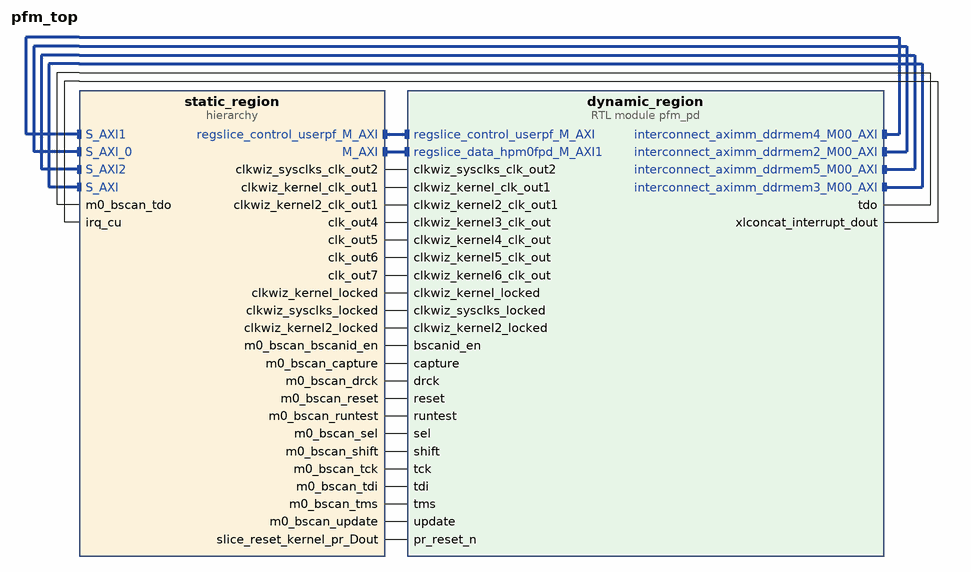
[diagram p0: block diagram of the top level]
# Vivado block design pfm_top, xczu9eg-ffvb1156-2-e, Vivado 2020.1
create_bd_design pfm_top

create_bd_cell -type module -reference pfm_pd dynamic_region
create_bd_cell -type hier static_region

# ---- hierarchy /static_region ----
current_bd_instance /static_region
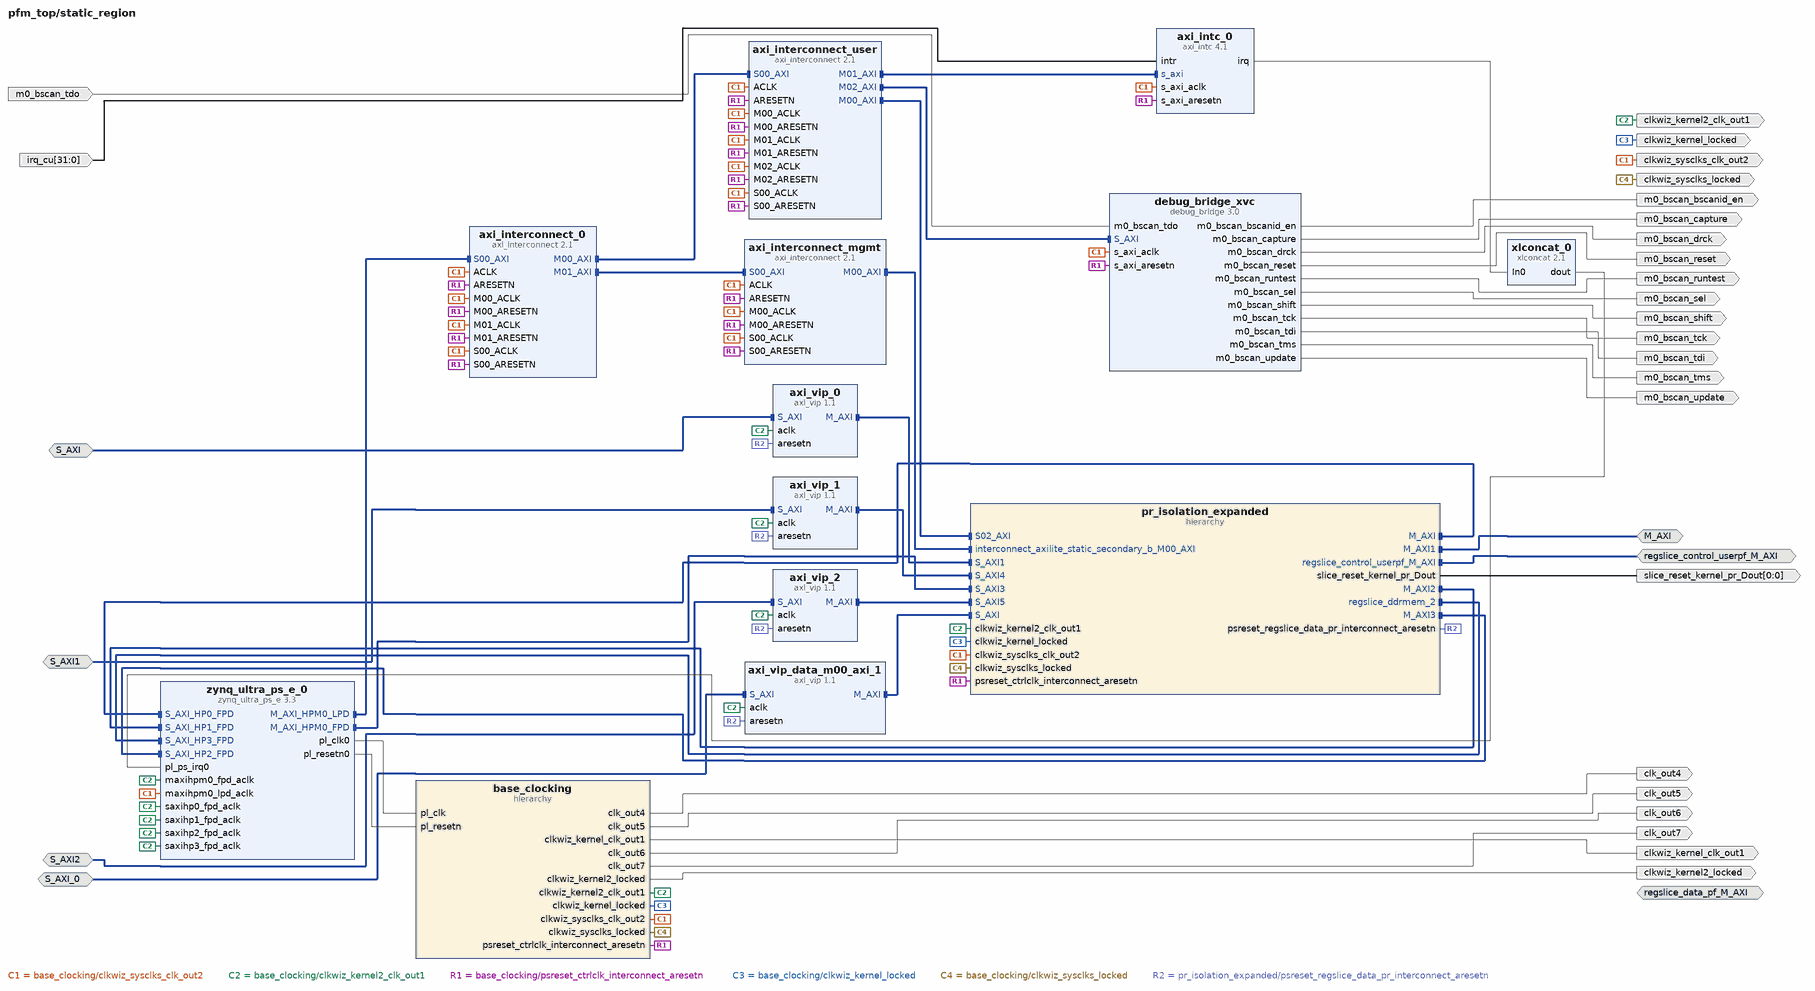
[diagram p1: block diagram inside /static_region]
create_bd_intf_pin -mode Master -vlnv xilinx.com:interface:aximm_rtl:1.0 M_AXI
create_bd_intf_pin -mode Slave -vlnv xilinx.com:interface:aximm_rtl:1.0 S_AXI
create_bd_intf_pin -mode Slave -vlnv xilinx.com:interface:aximm_rtl:1.0 S_AXI1
create_bd_intf_pin -mode Slave -vlnv xilinx.com:interface:aximm_rtl:1.0 S_AXI2
create_bd_intf_pin -mode Slave -vlnv xilinx.com:interface:aximm_rtl:1.0 S_AXI_0
create_bd_intf_pin -mode Master -vlnv xilinx.com:interface:aximm_rtl:1.0 regslice_control_userpf_M_AXI
create_bd_intf_pin -mode Master -vlnv xilinx.com:interface:aximm_rtl:1.0 regslice_data_pf_M_AXI
create_bd_pin -dir O -type clk clk_out4
create_bd_pin -dir O -type clk clk_out5
create_bd_pin -dir O -type clk clk_out6
create_bd_pin -dir O -type clk clk_out7
create_bd_pin -dir O -type clk clkwiz_kernel2_clk_out1
create_bd_pin -dir O clkwiz_kernel2_locked
create_bd_pin -dir O -type clk clkwiz_kernel_clk_out1
create_bd_pin -dir O clkwiz_kernel_locked
create_bd_pin -dir O -type clk clkwiz_sysclks_clk_out2
create_bd_pin -dir O clkwiz_sysclks_locked
create_bd_pin -dir I -from 31 -to 0 irq_cu
create_bd_pin -dir O m0_bscan_bscanid_en
create_bd_pin -dir O m0_bscan_capture
create_bd_pin -dir O -type clk m0_bscan_drck
create_bd_pin -dir O -type rst m0_bscan_reset
create_bd_pin -dir O m0_bscan_runtest
create_bd_pin -dir O m0_bscan_sel
create_bd_pin -dir O m0_bscan_shift
create_bd_pin -dir O -type clk m0_bscan_tck
create_bd_pin -dir O m0_bscan_tdi
create_bd_pin -dir I m0_bscan_tdo
create_bd_pin -dir O m0_bscan_tms
create_bd_pin -dir O -type clk m0_bscan_update
create_bd_pin -dir O -from 0 -to 0 slice_reset_kernel_pr_Dout

create_bd_cell -type ip -vlnv xilinx.com:ip:axi_intc:4.1 axi_intc_0
set_property -dict {CONFIG.C_ASYNC_INTR 0xFFFFFFFF CONFIG.C_IRQ_IS_LEVEL 1} [get_bd_cells axi_intc_0]
create_bd_cell -type ip -vlnv xilinx.com:ip:axi_interconnect:2.1 axi_interconnect_0
create_bd_cell -type ip -vlnv xilinx.com:ip:axi_interconnect:2.1 axi_interconnect_mgmt
set_property -dict {CONFIG.NUM_MI 1} [get_bd_cells axi_interconnect_mgmt]
create_bd_cell -type ip -vlnv xilinx.com:ip:axi_interconnect:2.1 axi_interconnect_user
set_property -dict {CONFIG.NUM_MI 3} [get_bd_cells axi_interconnect_user]
create_bd_cell -type ip -vlnv xilinx.com:ip:axi_vip:1.1 axi_vip_0
create_bd_cell -type ip -vlnv xilinx.com:ip:axi_vip:1.1 axi_vip_1
create_bd_cell -type ip -vlnv xilinx.com:ip:axi_vip:1.1 axi_vip_2
create_bd_cell -type ip -vlnv xilinx.com:ip:axi_vip:1.1 axi_vip_data_m00_axi_1
create_bd_cell -type hier base_clocking
create_bd_cell -type ip -vlnv xilinx.com:ip:debug_bridge:3.0 debug_bridge_xvc
set_property -dict [list \
  CONFIG.C_BSCAN_MUX 2 \
  CONFIG.C_DEBUG_MODE 2 \
  CONFIG.C_NUM_BS_MASTER 1 \
  CONFIG.C_XVC_HW_ID 0x0002 \
] [get_bd_cells debug_bridge_xvc]
create_bd_cell -type hier pr_isolation_expanded
create_bd_cell -type ip -vlnv xilinx.com:ip:xlconcat:2.1 xlconcat_0
set_property -dict {CONFIG.NUM_PORTS 1} [get_bd_cells xlconcat_0]
create_bd_cell -type ip -vlnv xilinx.com:ip:zynq_ultra_ps_e:3.3 zynq_ultra_ps_e_0
set_property -dict [list \
  CONFIG.PSU_BANK_0_IO_STANDARD LVCMOS18 \
  CONFIG.PSU_BANK_1_IO_STANDARD LVCMOS18 \
  CONFIG.PSU_BANK_2_IO_STANDARD LVCMOS18 \
  CONFIG.PSU_DYNAMIC_DDR_CONFIG_EN 1 \
  CONFIG.PSU_USB3__DUAL_CLOCK_ENABLE 1 \
  CONFIG.PSU__CAN1__PERIPHERAL__ENABLE 1 \
  CONFIG.PSU__CAN1__PERIPHERAL__IO {MIO 24 .. 25} \
  CONFIG.PSU__CRF_APB__ACPU_CTRL__FREQMHZ 1200 \
  CONFIG.PSU__CRF_APB__ACPU_CTRL__SRCSEL APLL \
  CONFIG.PSU__CRF_APB__APLL_CTRL__SRCSEL PSS_REF_CLK \
  CONFIG.PSU__CRF_APB__DBG_FPD_CTRL__FREQMHZ 250 \
  CONFIG.PSU__CRF_APB__DBG_FPD_CTRL__SRCSEL IOPLL \
  CONFIG.PSU__CRF_APB__DBG_TRACE_CTRL__FREQMHZ 250 \
  CONFIG.PSU__CRF_APB__DBG_TRACE_CTRL__SRCSEL IOPLL \
  CONFIG.PSU__CRF_APB__DBG_TSTMP_CTRL__FREQMHZ 250 \
  CONFIG.PSU__CRF_APB__DBG_TSTMP_CTRL__SRCSEL IOPLL \
  CONFIG.PSU__CRF_APB__DDR_CTRL__FREQMHZ 1067 \
  CONFIG.PSU__CRF_APB__DDR_CTRL__SRCSEL DPLL \
  CONFIG.PSU__CRF_APB__DPDMA_REF_CTRL__FREQMHZ 600 \
  CONFIG.PSU__CRF_APB__DPDMA_REF_CTRL__SRCSEL APLL \
  CONFIG.PSU__CRF_APB__DPLL_CTRL__SRCSEL PSS_REF_CLK \
  CONFIG.PSU__CRF_APB__DP_AUDIO_REF_CTRL__SRCSEL RPLL \
  CONFIG.PSU__CRF_APB__DP_STC_REF_CTRL__SRCSEL RPLL \
  CONFIG.PSU__CRF_APB__DP_VIDEO_REF_CTRL__SRCSEL VPLL \
  CONFIG.PSU__CRF_APB__GDMA_REF_CTRL__FREQMHZ 600 \
  CONFIG.PSU__CRF_APB__GDMA_REF_CTRL__SRCSEL APLL \
  CONFIG.PSU__CRF_APB__GPU_REF_CTRL__FREQMHZ 500 \
  CONFIG.PSU__CRF_APB__GPU_REF_CTRL__SRCSEL IOPLL \
  CONFIG.PSU__CRF_APB__TOPSW_LSBUS_CTRL__FREQMHZ 100 \
  CONFIG.PSU__CRF_APB__TOPSW_LSBUS_CTRL__SRCSEL IOPLL \
  CONFIG.PSU__CRF_APB__TOPSW_MAIN_CTRL__FREQMHZ 533.33 \
  CONFIG.PSU__CRF_APB__TOPSW_MAIN_CTRL__SRCSEL DPLL \
  CONFIG.PSU__CRF_APB__VPLL_CTRL__SRCSEL PSS_REF_CLK \
  CONFIG.PSU__CRL_APB__ADMA_REF_CTRL__FREQMHZ 500 \
  CONFIG.PSU__CRL_APB__ADMA_REF_CTRL__SRCSEL IOPLL \
  CONFIG.PSU__CRL_APB__CAN1_REF_CTRL__FREQMHZ 100 \
  CONFIG.PSU__CRL_APB__CAN1_REF_CTRL__SRCSEL IOPLL \
  CONFIG.PSU__CRL_APB__CPU_R5_CTRL__FREQMHZ 500 \
  CONFIG.PSU__CRL_APB__CPU_R5_CTRL__SRCSEL IOPLL \
  CONFIG.PSU__CRL_APB__DBG_LPD_CTRL__FREQMHZ 250 \
  CONFIG.PSU__CRL_APB__DBG_LPD_CTRL__SRCSEL IOPLL \
  CONFIG.PSU__CRL_APB__GEM3_REF_CTRL__FREQMHZ 125 \
  CONFIG.PSU__CRL_APB__GEM3_REF_CTRL__SRCSEL IOPLL \
  CONFIG.PSU__CRL_APB__I2C0_REF_CTRL__FREQMHZ 100 \
  CONFIG.PSU__CRL_APB__I2C0_REF_CTRL__SRCSEL IOPLL \
  CONFIG.PSU__CRL_APB__I2C1_REF_CTRL__FREQMHZ 100 \
  CONFIG.PSU__CRL_APB__I2C1_REF_CTRL__SRCSEL IOPLL \
  CONFIG.PSU__CRL_APB__IOPLL_CTRL__SRCSEL PSS_REF_CLK \
  CONFIG.PSU__CRL_APB__IOU_SWITCH_CTRL__FREQMHZ 250 \
  CONFIG.PSU__CRL_APB__IOU_SWITCH_CTRL__SRCSEL IOPLL \
  CONFIG.PSU__CRL_APB__LPD_LSBUS_CTRL__FREQMHZ 100 \
  CONFIG.PSU__CRL_APB__LPD_LSBUS_CTRL__SRCSEL IOPLL \
  CONFIG.PSU__CRL_APB__LPD_SWITCH_CTRL__FREQMHZ 500 \
  CONFIG.PSU__CRL_APB__LPD_SWITCH_CTRL__SRCSEL IOPLL \
  CONFIG.PSU__CRL_APB__PCAP_CTRL__FREQMHZ 200 \
  CONFIG.PSU__CRL_APB__PCAP_CTRL__SRCSEL IOPLL \
  CONFIG.PSU__CRL_APB__PL0_REF_CTRL__FREQMHZ 50 \
  CONFIG.PSU__CRL_APB__PL0_REF_CTRL__SRCSEL IOPLL \
  CONFIG.PSU__CRL_APB__QSPI_REF_CTRL__FREQMHZ 125 \
  CONFIG.PSU__CRL_APB__QSPI_REF_CTRL__SRCSEL IOPLL \
  CONFIG.PSU__CRL_APB__RPLL_CTRL__SRCSEL PSS_REF_CLK \
  CONFIG.PSU__CRL_APB__SDIO1_REF_CTRL__FREQMHZ 200 \
  CONFIG.PSU__CRL_APB__SDIO1_REF_CTRL__SRCSEL IOPLL \
  CONFIG.PSU__CRL_APB__TIMESTAMP_REF_CTRL__FREQMHZ 100 \
  CONFIG.PSU__CRL_APB__TIMESTAMP_REF_CTRL__SRCSEL IOPLL \
  CONFIG.PSU__CRL_APB__UART0_REF_CTRL__FREQMHZ 100 \
  CONFIG.PSU__CRL_APB__UART0_REF_CTRL__SRCSEL IOPLL \
  CONFIG.PSU__CRL_APB__UART1_REF_CTRL__FREQMHZ 100 \
  CONFIG.PSU__CRL_APB__UART1_REF_CTRL__SRCSEL IOPLL \
  CONFIG.PSU__CRL_APB__USB0_BUS_REF_CTRL__FREQMHZ 250 \
  CONFIG.PSU__CRL_APB__USB0_BUS_REF_CTRL__SRCSEL IOPLL \
  CONFIG.PSU__CRL_APB__USB3_DUAL_REF_CTRL__FREQMHZ 20 \
  CONFIG.PSU__CRL_APB__USB3_DUAL_REF_CTRL__SRCSEL IOPLL \
  CONFIG.PSU__CRL_APB__USB3__ENABLE 1 \
  CONFIG.PSU__CSUPMU__PERIPHERAL__VALID 1 \
  CONFIG.PSU__DDRC__BUS_WIDTH {64 Bit} \
  CONFIG.PSU__DDRC__COMPONENTS UDIMM \
  CONFIG.PSU__DDRC__DEVICE_CAPACITY {4096 MBits} \
  CONFIG.PSU__DDRC__DRAM_WIDTH {8 Bits} \
  CONFIG.PSU__DDRC__ECC Disabled \
  CONFIG.PSU__DDRC__MEMORY_TYPE {DDR 4} \
  CONFIG.PSU__DDRC__SPEED_BIN DDR4_2133P \
  CONFIG.PSU__DDR_HIGH_ADDRESS_GUI_ENABLE 1 \
  CONFIG.PSU__DDR__INTERFACE__FREQMHZ 533.500 \
  CONFIG.PSU__DISPLAYPORT__LANE0__ENABLE 1 \
  CONFIG.PSU__DISPLAYPORT__LANE0__IO {GT Lane1} \
  CONFIG.PSU__DISPLAYPORT__LANE1__ENABLE 0 \
  CONFIG.PSU__DISPLAYPORT__PERIPHERAL__ENABLE 1 \
  CONFIG.PSU__DLL__ISUSED 1 \
  CONFIG.PSU__DPAUX__PERIPHERAL__ENABLE 1 \
  CONFIG.PSU__DPAUX__PERIPHERAL__IO {MIO 27 .. 30} \
  CONFIG.PSU__DP__LANE_SEL {Single Lower} \
  CONFIG.PSU__DP__REF_CLK_FREQ 27 \
  CONFIG.PSU__DP__REF_CLK_SEL {Ref Clk3} \
  CONFIG.PSU__ENET3__FIFO__ENABLE 0 \
  CONFIG.PSU__ENET3__GRP_MDIO__ENABLE 1 \
  CONFIG.PSU__ENET3__GRP_MDIO__IO {MIO 76 .. 77} \
  CONFIG.PSU__ENET3__PERIPHERAL__ENABLE 1 \
  CONFIG.PSU__ENET3__PERIPHERAL__IO {MIO 64 .. 75} \
  CONFIG.PSU__ENET3__PTP__ENABLE 0 \
  CONFIG.PSU__ENET3__TSU__ENABLE 0 \
  CONFIG.PSU__FPGA_PL0_ENABLE 1 \
  CONFIG.PSU__GEM3_COHERENCY 0 \
  CONFIG.PSU__GEM3_ROUTE_THROUGH_FPD 0 \
  CONFIG.PSU__GEM__TSU__ENABLE 0 \
  CONFIG.PSU__GPIO0_MIO__IO {MIO 0 .. 25} \
  CONFIG.PSU__GPIO0_MIO__PERIPHERAL__ENABLE 1 \
  CONFIG.PSU__GPIO1_MIO__IO {MIO 26 .. 51} \
  CONFIG.PSU__GPIO1_MIO__PERIPHERAL__ENABLE 1 \
  CONFIG.PSU__GT__LINK_SPEED HBR \
  CONFIG.PSU__GT__PRE_EMPH_LVL_4 0 \
  CONFIG.PSU__GT__VLT_SWNG_LVL_4 0 \
  CONFIG.PSU__I2C0__PERIPHERAL__ENABLE 1 \
  CONFIG.PSU__I2C0__PERIPHERAL__IO {MIO 14 .. 15} \
  CONFIG.PSU__I2C1__PERIPHERAL__ENABLE 1 \
  CONFIG.PSU__I2C1__PERIPHERAL__IO {MIO 16 .. 17} \
  CONFIG.PSU__IOU_SLCR__IOU_TTC_APB_CLK__TTC0_SEL APB \
  CONFIG.PSU__IOU_SLCR__IOU_TTC_APB_CLK__TTC1_SEL APB \
  CONFIG.PSU__IOU_SLCR__IOU_TTC_APB_CLK__TTC2_SEL APB \
  CONFIG.PSU__IOU_SLCR__IOU_TTC_APB_CLK__TTC3_SEL APB \
  CONFIG.PSU__MAXIGP0__DATA_WIDTH 128 \
  CONFIG.PSU__OVERRIDE__BASIC_CLOCK 0 \
  CONFIG.PSU__PCIE__BAR0_VAL 0x0 \
  CONFIG.PSU__PCIE__BAR1_VAL 0x0 \
  CONFIG.PSU__PCIE__BAR2_VAL 0x0 \
  CONFIG.PSU__PCIE__BAR3_VAL 0x0 \
  CONFIG.PSU__PCIE__BAR4_VAL 0x0 \
  CONFIG.PSU__PCIE__BAR5_VAL 0x0 \
  CONFIG.PSU__PCIE__CLASS_CODE_BASE 0x06 \
  CONFIG.PSU__PCIE__CLASS_CODE_INTERFACE 0x0 \
  CONFIG.PSU__PCIE__CLASS_CODE_SUB 0x4 \
  CONFIG.PSU__PCIE__CLASS_CODE_VALUE 0x60400 \
  CONFIG.PSU__PCIE__CRS_SW_VISIBILITY 1 \
  CONFIG.PSU__PCIE__DEVICE_ID 0xD021 \
  CONFIG.PSU__PCIE__DEVICE_PORT_TYPE {Root Port} \
  CONFIG.PSU__PCIE__EROM_VAL 0x0 \
  CONFIG.PSU__PCIE__LANE0__ENABLE 1 \
  CONFIG.PSU__PCIE__LANE0__IO {GT Lane0} \
  CONFIG.PSU__PCIE__LINK_SPEED {5.0 Gb/s} \
  CONFIG.PSU__PCIE__MAXIMUM_LINK_WIDTH x1 \
  CONFIG.PSU__PCIE__MAX_PAYLOAD_SIZE {256 bytes} \
  CONFIG.PSU__PCIE__PERIPHERAL__ENABLE 1 \
  CONFIG.PSU__PCIE__PERIPHERAL__ENDPOINT_ENABLE 0 \
  CONFIG.PSU__PCIE__PERIPHERAL__ROOTPORT_ENABLE 1 \
  CONFIG.PSU__PCIE__PERIPHERAL__ROOTPORT_IO {MIO 31} \
  CONFIG.PSU__PCIE__REF_CLK_FREQ 100 \
  CONFIG.PSU__PCIE__REF_CLK_SEL {Ref Clk0} \
  CONFIG.PSU__PCIE__REVISION_ID 0x0 \
  CONFIG.PSU__PCIE__SUBSYSTEM_ID 0x7 \
  CONFIG.PSU__PCIE__SUBSYSTEM_VENDOR_ID 0x10EE \
  CONFIG.PSU__PCIE__VENDOR_ID 0x10EE \
  CONFIG.PSU__PMU_COHERENCY 0 \
  CONFIG.PSU__PMU__AIBACK__ENABLE 0 \
  CONFIG.PSU__PMU__EMIO_GPI__ENABLE 0 \
  CONFIG.PSU__PMU__EMIO_GPO__ENABLE 0 \
  CONFIG.PSU__PMU__GPI0__ENABLE 0 \
  CONFIG.PSU__PMU__GPI1__ENABLE 0 \
  CONFIG.PSU__PMU__GPI2__ENABLE 0 \
  CONFIG.PSU__PMU__GPI3__ENABLE 0 \
  CONFIG.PSU__PMU__GPI4__ENABLE 0 \
  CONFIG.PSU__PMU__GPI5__ENABLE 0 \
  CONFIG.PSU__PMU__GPO0__ENABLE 1 \
  CONFIG.PSU__PMU__GPO0__IO {MIO 32} \
  CONFIG.PSU__PMU__GPO1__ENABLE 1 \
  CONFIG.PSU__PMU__GPO1__IO {MIO 33} \
  CONFIG.PSU__PMU__GPO2__ENABLE 1 \
  CONFIG.PSU__PMU__GPO2__IO {MIO 34} \
  CONFIG.PSU__PMU__GPO2__POLARITY low \
  CONFIG.PSU__PMU__GPO3__ENABLE 1 \
  CONFIG.PSU__PMU__GPO3__IO {MIO 35} \
  CONFIG.PSU__PMU__GPO3__POLARITY low \
  CONFIG.PSU__PMU__GPO4__ENABLE 1 \
  CONFIG.PSU__PMU__GPO4__IO {MIO 36} \
  CONFIG.PSU__PMU__GPO4__POLARITY low \
  CONFIG.PSU__PMU__GPO5__ENABLE 1 \
  CONFIG.PSU__PMU__GPO5__IO {MIO 37} \
  CONFIG.PSU__PMU__GPO5__POLARITY low \
  CONFIG.PSU__PMU__PERIPHERAL__ENABLE 1 \
  CONFIG.PSU__PMU__PLERROR__ENABLE 0 \
  CONFIG.PSU__PSS_REF_CLK__FREQMHZ 33.333333 \
  CONFIG.PSU__QSPI_COHERENCY 0 \
  CONFIG.PSU__QSPI_ROUTE_THROUGH_FPD 0 \
  CONFIG.PSU__QSPI__GRP_FBCLK__ENABLE 1 \
  CONFIG.PSU__QSPI__GRP_FBCLK__IO {MIO 6} \
  CONFIG.PSU__QSPI__PERIPHERAL__DATA_MODE x4 \
  CONFIG.PSU__QSPI__PERIPHERAL__ENABLE 1 \
  CONFIG.PSU__QSPI__PERIPHERAL__IO {MIO 0 .. 12} \
  CONFIG.PSU__QSPI__PERIPHERAL__MODE {Dual Parallel} \
  CONFIG.PSU__SATA__LANE1__IO {GT Lane3} \
  CONFIG.PSU__SATA__PERIPHERAL__ENABLE 1 \
  CONFIG.PSU__SATA__REF_CLK_FREQ 125 \
  CONFIG.PSU__SATA__REF_CLK_SEL {Ref Clk1} \
  CONFIG.PSU__SD1_COHERENCY 0 \
  CONFIG.PSU__SD1_ROUTE_THROUGH_FPD 0 \
  CONFIG.PSU__SD1__DATA_TRANSFER_MODE 8Bit \
  CONFIG.PSU__SD1__GRP_CD__ENABLE 1 \
  CONFIG.PSU__SD1__GRP_CD__IO {MIO 45} \
  CONFIG.PSU__SD1__GRP_POW__ENABLE 1 \
  CONFIG.PSU__SD1__GRP_POW__IO {MIO 43} \
  CONFIG.PSU__SD1__GRP_WP__ENABLE 1 \
  CONFIG.PSU__SD1__GRP_WP__IO {MIO 44} \
  CONFIG.PSU__SD1__PERIPHERAL__ENABLE 1 \
  CONFIG.PSU__SD1__PERIPHERAL__IO {MIO 39 .. 51} \
  CONFIG.PSU__SD1__SLOT_TYPE {SD 3.0} \
  CONFIG.PSU__SWDT0__CLOCK__ENABLE 0 \
  CONFIG.PSU__SWDT0__PERIPHERAL__ENABLE 1 \
  CONFIG.PSU__SWDT0__RESET__ENABLE 0 \
  CONFIG.PSU__SWDT1__CLOCK__ENABLE 0 \
  CONFIG.PSU__SWDT1__PERIPHERAL__ENABLE 1 \
  CONFIG.PSU__SWDT1__RESET__ENABLE 0 \
  CONFIG.PSU__TSU__BUFG_PORT_PAIR 0 \
  CONFIG.PSU__TTC0__CLOCK__ENABLE 0 \
  CONFIG.PSU__TTC0__PERIPHERAL__ENABLE 1 \
  CONFIG.PSU__TTC0__WAVEOUT__ENABLE 0 \
  CONFIG.PSU__TTC1__CLOCK__ENABLE 0 \
  CONFIG.PSU__TTC1__PERIPHERAL__ENABLE 1 \
  CONFIG.PSU__TTC1__WAVEOUT__ENABLE 0 \
  CONFIG.PSU__TTC2__CLOCK__ENABLE 0 \
  CONFIG.PSU__TTC2__PERIPHERAL__ENABLE 1 \
  CONFIG.PSU__TTC2__WAVEOUT__ENABLE 0 \
  CONFIG.PSU__TTC3__CLOCK__ENABLE 0 \
  CONFIG.PSU__TTC3__PERIPHERAL__ENABLE 1 \
  CONFIG.PSU__TTC3__WAVEOUT__ENABLE 0 \
  CONFIG.PSU__UART0__BAUD_RATE 115200 \
  CONFIG.PSU__UART0__MODEM__ENABLE 0 \
  CONFIG.PSU__UART0__PERIPHERAL__ENABLE 1 \
  CONFIG.PSU__UART0__PERIPHERAL__IO {MIO 18 .. 19} \
  CONFIG.PSU__UART1__BAUD_RATE 115200 \
  CONFIG.PSU__UART1__MODEM__ENABLE 0 \
  CONFIG.PSU__UART1__PERIPHERAL__ENABLE 1 \
  CONFIG.PSU__UART1__PERIPHERAL__IO {MIO 20 .. 21} \
  CONFIG.PSU__USB0_COHERENCY 0 \
  CONFIG.PSU__USB0__PERIPHERAL__ENABLE 1 \
  CONFIG.PSU__USB0__PERIPHERAL__IO {MIO 52 .. 63} \
  CONFIG.PSU__USB0__REF_CLK_FREQ 26 \
  CONFIG.PSU__USB0__REF_CLK_SEL {Ref Clk2} \
  CONFIG.PSU__USB2_0__EMIO__ENABLE 0 \
  CONFIG.PSU__USB3_0__EMIO__ENABLE 0 \
  CONFIG.PSU__USB3_0__PERIPHERAL__ENABLE 1 \
  CONFIG.PSU__USB3_0__PERIPHERAL__IO {GT Lane2} \
  CONFIG.PSU__USB__RESET__MODE {Boot Pin} \
  CONFIG.PSU__USB__RESET__POLARITY {Active Low} \
  CONFIG.PSU__USE__IRQ0 1 \
  CONFIG.PSU__USE__M_AXI_GP0 1 \
  CONFIG.PSU__USE__M_AXI_GP2 1 \
  CONFIG.PSU__USE__S_AXI_GP2 1 \
  CONFIG.PSU__USE__S_AXI_GP3 1 \
  CONFIG.PSU__USE__S_AXI_GP4 1 \
  CONFIG.PSU__USE__S_AXI_GP5 1 \
  CONFIG.SUBPRESET1 Custom \
] [get_bd_cells zynq_ultra_ps_e_0]
# 112 more settings of zynq_ultra_ps_e_0 are not shown: defaults, MIO pin electricals, DDR timing, and values the tool derives

# ---- hierarchy /static_region/base_clocking ----
current_bd_instance /static_region/base_clocking
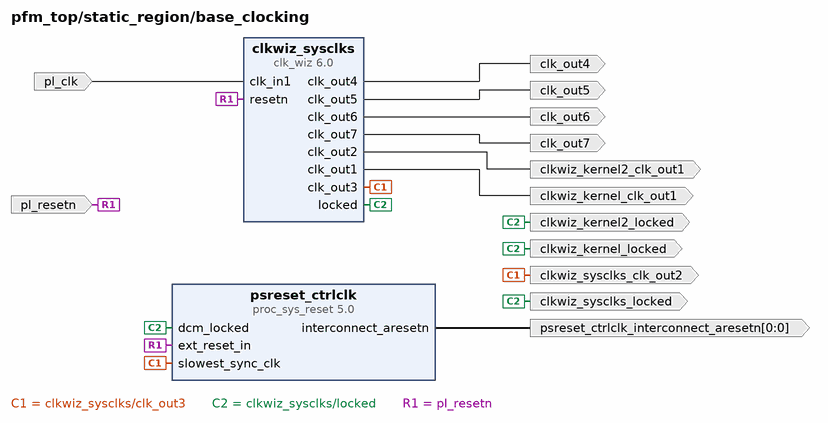
[diagram p2: block diagram inside /static_region/base_clocking]
create_bd_pin -dir O -type clk clk_out4
create_bd_pin -dir O -type clk clk_out5
create_bd_pin -dir O -type clk clk_out6
create_bd_pin -dir O -type clk clk_out7
create_bd_pin -dir O -type clk clkwiz_kernel2_clk_out1
create_bd_pin -dir O clkwiz_kernel2_locked
create_bd_pin -dir O -type clk clkwiz_kernel_clk_out1
create_bd_pin -dir O clkwiz_kernel_locked
create_bd_pin -dir O -type clk clkwiz_sysclks_clk_out2
create_bd_pin -dir O clkwiz_sysclks_locked
create_bd_pin -dir I -type clk pl_clk
create_bd_pin -dir I -type rst pl_resetn
create_bd_pin -dir O -from 0 -to 0 -type rst psreset_ctrlclk_interconnect_aresetn

create_bd_cell -type ip -vlnv xilinx.com:ip:clk_wiz:6.0 clkwiz_sysclks
set_property -dict [list \
  CONFIG.CLKOUT1_DRIVES Buffer \
  CONFIG.CLKOUT1_JITTER 129.922 \
  CONFIG.CLKOUT1_PHASE_ERROR 154.678 \
  CONFIG.CLKOUT1_REQUESTED_OUT_FREQ 149.98500 \
  CONFIG.CLKOUT2_DRIVES Buffer \
  CONFIG.CLKOUT2_JITTER 116.496 \
  CONFIG.CLKOUT2_PHASE_ERROR 154.678 \
  CONFIG.CLKOUT2_REQUESTED_OUT_FREQ 299.97000 \
  CONFIG.CLKOUT2_USED true \
  CONFIG.CLKOUT3_DRIVES Buffer \
  CONFIG.CLKOUT3_JITTER 148.365 \
  CONFIG.CLKOUT3_PHASE_ERROR 154.678 \
  CONFIG.CLKOUT3_REQUESTED_OUT_FREQ 74.99250 \
  CONFIG.CLKOUT3_USED true \
  CONFIG.CLKOUT4_DRIVES Buffer \
  CONFIG.CLKOUT4_JITTER 139.127 \
  CONFIG.CLKOUT4_PHASE_ERROR 154.678 \
  CONFIG.CLKOUT4_REQUESTED_OUT_FREQ 99.99000 \
  CONFIG.CLKOUT4_USED true \
  CONFIG.CLKOUT5_DRIVES Buffer \
  CONFIG.CLKOUT5_JITTER 124.134 \
  CONFIG.CLKOUT5_PHASE_ERROR 154.678 \
  CONFIG.CLKOUT5_REQUESTED_OUT_FREQ 199.9800 \
  CONFIG.CLKOUT5_USED true \
  CONFIG.CLKOUT6_DRIVES Buffer \
  CONFIG.CLKOUT6_JITTER 111.427 \
  CONFIG.CLKOUT6_PHASE_ERROR 154.678 \
  CONFIG.CLKOUT6_REQUESTED_OUT_FREQ 399.9600 \
  CONFIG.CLKOUT6_USED true \
  CONFIG.CLKOUT7_DRIVES Buffer \
  CONFIG.CLKOUT7_JITTER 104.747 \
  CONFIG.CLKOUT7_PHASE_ERROR 154.678 \
  CONFIG.CLKOUT7_REQUESTED_OUT_FREQ 599.9400 \
  CONFIG.CLKOUT7_USED true \
  CONFIG.FEEDBACK_SOURCE FDBK_AUTO \
  CONFIG.MMCM_BANDWIDTH OPTIMIZED \
  CONFIG.MMCM_CLKFBOUT_MULT_F 24.000 \
  CONFIG.MMCM_CLKOUT0_DIVIDE_F 8.000 \
  CONFIG.MMCM_CLKOUT1_DIVIDE 4 \
  CONFIG.MMCM_CLKOUT2_DIVIDE 16 \
  CONFIG.MMCM_CLKOUT3_DIVIDE 12 \
  CONFIG.MMCM_CLKOUT4_DIVIDE 6 \
  CONFIG.MMCM_CLKOUT5_DIVIDE 3 \
  CONFIG.MMCM_CLKOUT6_DIVIDE 2 \
  CONFIG.MMCM_COMPENSATION AUTO \
  CONFIG.MMCM_DIVCLK_DIVIDE 1 \
  CONFIG.NUM_OUT_CLKS 7 \
  CONFIG.PRIMITIVE MMCM \
  CONFIG.PRIM_SOURCE No_buffer \
  CONFIG.RESET_PORT resetn \
  CONFIG.RESET_TYPE ACTIVE_LOW \
  CONFIG.SECONDARY_SOURCE Single_ended_clock_capable_pin \
  CONFIG.USE_PHASE_ALIGNMENT false \
] [get_bd_cells clkwiz_sysclks]
create_bd_cell -type ip -vlnv xilinx.com:ip:proc_sys_reset:5.0 psreset_ctrlclk
set_property -dict {CONFIG.C_AUX_RST_WIDTH 1 CONFIG.C_EXT_RST_WIDTH 1} [get_bd_cells psreset_ctrlclk]

# ---- hierarchy /static_region/pr_isolation_expanded ----
current_bd_instance /static_region/pr_isolation_expanded
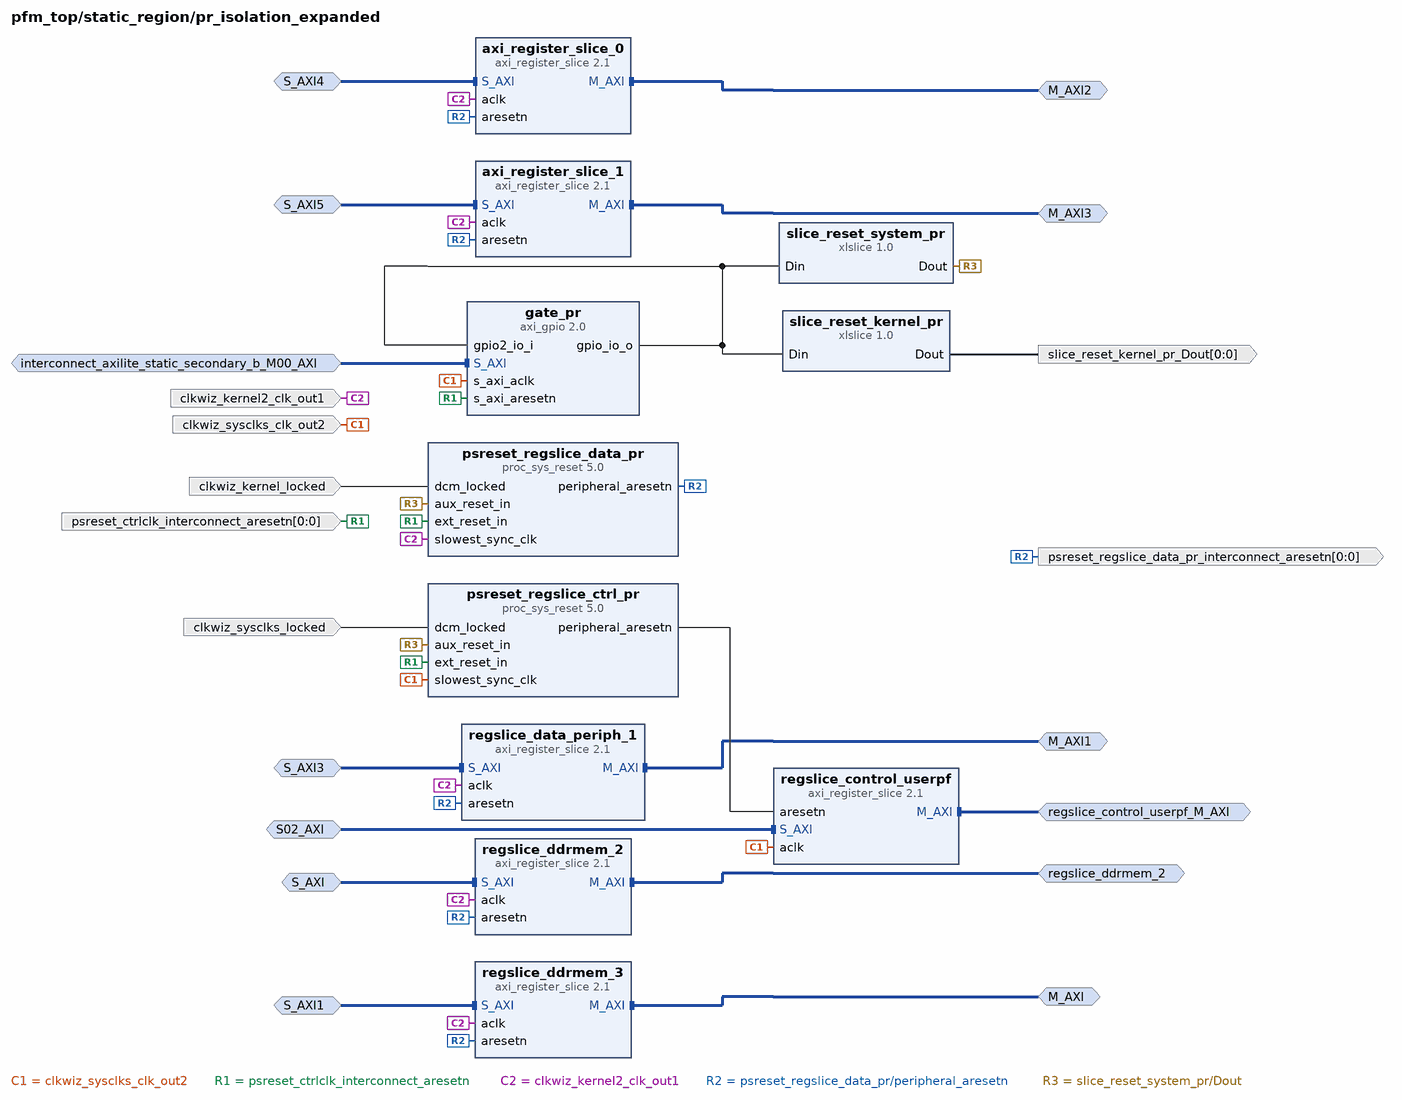
[diagram p3: block diagram inside /static_region/pr_isolation_expanded]
create_bd_intf_pin -mode Master -vlnv xilinx.com:interface:aximm_rtl:1.0 M_AXI
create_bd_intf_pin -mode Master -vlnv xilinx.com:interface:aximm_rtl:1.0 M_AXI1
create_bd_intf_pin -mode Master -vlnv xilinx.com:interface:aximm_rtl:1.0 M_AXI2
create_bd_intf_pin -mode Master -vlnv xilinx.com:interface:aximm_rtl:1.0 M_AXI3
create_bd_intf_pin -mode Slave -vlnv xilinx.com:interface:aximm_rtl:1.0 S02_AXI
create_bd_intf_pin -mode Slave -vlnv xilinx.com:interface:aximm_rtl:1.0 S_AXI
create_bd_intf_pin -mode Slave -vlnv xilinx.com:interface:aximm_rtl:1.0 S_AXI1
create_bd_intf_pin -mode Slave -vlnv xilinx.com:interface:aximm_rtl:1.0 S_AXI3
create_bd_intf_pin -mode Slave -vlnv xilinx.com:interface:aximm_rtl:1.0 S_AXI4
create_bd_intf_pin -mode Slave -vlnv xilinx.com:interface:aximm_rtl:1.0 S_AXI5
create_bd_intf_pin -mode Slave -vlnv xilinx.com:interface:aximm_rtl:1.0 interconnect_axilite_static_secondary_b_M00_AXI
create_bd_intf_pin -mode Master -vlnv xilinx.com:interface:aximm_rtl:1.0 regslice_control_userpf_M_AXI
create_bd_intf_pin -mode Master -vlnv xilinx.com:interface:aximm_rtl:1.0 regslice_ddrmem_2
create_bd_pin -dir I -type clk clkwiz_kernel2_clk_out1
create_bd_pin -dir I clkwiz_kernel_locked
create_bd_pin -dir I -type clk clkwiz_sysclks_clk_out2
create_bd_pin -dir I clkwiz_sysclks_locked
create_bd_pin -dir I -from 0 -to 0 -type rst psreset_ctrlclk_interconnect_aresetn
create_bd_pin -dir O -from 0 -to 0 -type rst psreset_regslice_data_pr_interconnect_aresetn
create_bd_pin -dir O -from 0 -to 0 slice_reset_kernel_pr_Dout

create_bd_cell -type ip -vlnv xilinx.com:ip:axi_register_slice:2.1 axi_register_slice_0
create_bd_cell -type ip -vlnv xilinx.com:ip:axi_register_slice:2.1 axi_register_slice_1
create_bd_cell -type ip -vlnv xilinx.com:ip:axi_gpio:2.0 gate_pr
set_property -dict [list \
  CONFIG.C_ALL_INPUTS_2 1 \
  CONFIG.C_ALL_OUTPUTS 1 \
  CONFIG.C_DOUT_DEFAULT 0xFFFFFFFF \
  CONFIG.C_GPIO2_WIDTH 2 \
  CONFIG.C_GPIO_WIDTH 2 \
  CONFIG.C_IS_DUAL 1 \
] [get_bd_cells gate_pr]
create_bd_cell -type ip -vlnv xilinx.com:ip:proc_sys_reset:5.0 psreset_regslice_ctrl_pr
set_property -dict {CONFIG.C_AUX_RST_WIDTH 1 CONFIG.C_EXT_RST_WIDTH 1} [get_bd_cells psreset_regslice_ctrl_pr]
create_bd_cell -type ip -vlnv xilinx.com:ip:proc_sys_reset:5.0 psreset_regslice_data_pr
set_property -dict {CONFIG.C_AUX_RST_WIDTH 1 CONFIG.C_EXT_RST_WIDTH 1} [get_bd_cells psreset_regslice_data_pr]
create_bd_cell -type ip -vlnv xilinx.com:ip:axi_register_slice:2.1 regslice_control_userpf
set_property -dict {CONFIG.ADDR_WIDTH 32 CONFIG.DATA_WIDTH 32} [get_bd_cells regslice_control_userpf]
create_bd_cell -type ip -vlnv xilinx.com:ip:axi_register_slice:2.1 regslice_data_periph_1
set_property -dict [list \
  CONFIG.READ_WRITE_MODE READ_WRITE \
  CONFIG.REG_AR 1 \
  CONFIG.REG_AW 1 \
  CONFIG.REG_B 1 \
] [get_bd_cells regslice_data_periph_1]
create_bd_cell -type ip -vlnv xilinx.com:ip:axi_register_slice:2.1 regslice_ddrmem_2
create_bd_cell -type ip -vlnv xilinx.com:ip:axi_register_slice:2.1 regslice_ddrmem_3
create_bd_cell -type ip -vlnv xilinx.com:ip:xlslice:1.0 slice_reset_kernel_pr
set_property -dict {CONFIG.DIN_FROM 1 CONFIG.DIN_TO 1 CONFIG.DIN_WIDTH 2} [get_bd_cells slice_reset_kernel_pr]
create_bd_cell -type ip -vlnv xilinx.com:ip:xlslice:1.0 slice_reset_system_pr
set_property -dict {CONFIG.DIN_FROM 0 CONFIG.DIN_TO 0 CONFIG.DIN_WIDTH 2} [get_bd_cells slice_reset_system_pr]

# ---- connections ----

current_bd_instance /static_region
connect_bd_intf_net [get_bd_intf_pins S_AXI] [get_bd_intf_pins axi_vip_0/S_AXI]
connect_bd_intf_net [get_bd_intf_pins regslice_control_userpf_M_AXI] [get_bd_intf_pins pr_isolation_expanded/regslice_control_userpf_M_AXI]
connect_bd_intf_net [get_bd_intf_pins pr_isolation_expanded/M_AXI] [get_bd_intf_pins zynq_ultra_ps_e_0/S_AXI_HP0_FPD]
connect_bd_intf_net [get_bd_intf_pins pr_isolation_expanded/M_AXI2] [get_bd_intf_pins zynq_ultra_ps_e_0/S_AXI_HP1_FPD]
connect_bd_intf_net [get_bd_intf_pins M_AXI] [get_bd_intf_pins pr_isolation_expanded/M_AXI1]
connect_bd_intf_net [get_bd_intf_pins axi_vip_1/M_AXI] [get_bd_intf_pins pr_isolation_expanded/S_AXI4]
connect_bd_intf_net [get_bd_intf_pins axi_vip_0/M_AXI] [get_bd_intf_pins pr_isolation_expanded/S_AXI1]
connect_bd_intf_net -intf_net S_AXI_0_1 [get_bd_intf_pins S_AXI_0] [get_bd_intf_pins axi_vip_data_m00_axi_1/S_AXI]
connect_bd_intf_net [get_bd_intf_pins axi_interconnect_0/M00_AXI] [get_bd_intf_pins axi_interconnect_user/S00_AXI]
connect_bd_intf_net [get_bd_intf_pins axi_interconnect_mgmt/M00_AXI] [get_bd_intf_pins pr_isolation_expanded/interconnect_axilite_static_secondary_b_M00_AXI]
connect_bd_intf_net [get_bd_intf_pins axi_vip_2/M_AXI] [get_bd_intf_pins pr_isolation_expanded/S_AXI5]
connect_bd_intf_net [get_bd_intf_pins pr_isolation_expanded/S_AXI3] [get_bd_intf_pins zynq_ultra_ps_e_0/M_AXI_HPM0_FPD]
connect_bd_intf_net [get_bd_intf_pins pr_isolation_expanded/regslice_ddrmem_2] [get_bd_intf_pins zynq_ultra_ps_e_0/S_AXI_HP3_FPD]
connect_bd_intf_net [get_bd_intf_pins pr_isolation_expanded/M_AXI3] [get_bd_intf_pins zynq_ultra_ps_e_0/S_AXI_HP2_FPD]
connect_bd_intf_net [get_bd_intf_pins S_AXI2] [get_bd_intf_pins axi_vip_2/S_AXI]
connect_bd_intf_net [get_bd_intf_pins axi_interconnect_0/M01_AXI] [get_bd_intf_pins axi_interconnect_mgmt/S00_AXI]
connect_bd_intf_net [get_bd_intf_pins axi_interconnect_0/S00_AXI] [get_bd_intf_pins zynq_ultra_ps_e_0/M_AXI_HPM0_LPD]
connect_bd_intf_net [get_bd_intf_pins axi_interconnect_user/M00_AXI] [get_bd_intf_pins pr_isolation_expanded/S02_AXI]
connect_bd_intf_net [get_bd_intf_pins axi_intc_0/s_axi] [get_bd_intf_pins axi_interconnect_user/M01_AXI]
connect_bd_intf_net [get_bd_intf_pins axi_interconnect_user/M02_AXI] [get_bd_intf_pins debug_bridge_xvc/S_AXI]
connect_bd_intf_net [get_bd_intf_pins S_AXI1] [get_bd_intf_pins axi_vip_1/S_AXI]
connect_bd_intf_net [get_bd_intf_pins axi_vip_data_m00_axi_1/M_AXI] [get_bd_intf_pins pr_isolation_expanded/S_AXI]
connect_bd_net [get_bd_pins axi_intc_0/irq] [get_bd_pins xlconcat_0/In0]
connect_bd_net -net base_clocking_clk_out1 [get_bd_pins base_clocking/clkwiz_kernel_clk_out1] [get_bd_pins clkwiz_kernel_clk_out1]
connect_bd_net -net base_clocking_clk_out2 [get_bd_pins base_clocking/clkwiz_sysclks_clk_out2] \
  [get_bd_pins clkwiz_sysclks_clk_out2] [get_bd_pins axi_intc_0/s_axi_aclk] [get_bd_pins axi_interconnect_0/ACLK] \
  [get_bd_pins axi_interconnect_0/M00_ACLK] [get_bd_pins axi_interconnect_0/M01_ACLK] \
  [get_bd_pins axi_interconnect_0/S00_ACLK] [get_bd_pins axi_interconnect_mgmt/ACLK] \
  [get_bd_pins axi_interconnect_mgmt/M00_ACLK] [get_bd_pins axi_interconnect_mgmt/S00_ACLK] \
  [get_bd_pins axi_interconnect_user/ACLK] [get_bd_pins axi_interconnect_user/M00_ACLK] \
  [get_bd_pins axi_interconnect_user/M01_ACLK] [get_bd_pins axi_interconnect_user/M02_ACLK] \
  [get_bd_pins axi_interconnect_user/S00_ACLK] [get_bd_pins debug_bridge_xvc/s_axi_aclk] \
  [get_bd_pins pr_isolation_expanded/clkwiz_sysclks_clk_out2] [get_bd_pins zynq_ultra_ps_e_0/maxihpm0_lpd_aclk]
connect_bd_net -net base_clocking_clk_out4 [get_bd_pins base_clocking/clkwiz_kernel2_clk_out1] \
  [get_bd_pins clkwiz_kernel2_clk_out1] [get_bd_pins axi_vip_0/aclk] [get_bd_pins axi_vip_1/aclk] \
  [get_bd_pins axi_vip_2/aclk] [get_bd_pins axi_vip_data_m00_axi_1/aclk] \
  [get_bd_pins pr_isolation_expanded/clkwiz_kernel2_clk_out1] [get_bd_pins zynq_ultra_ps_e_0/maxihpm0_fpd_aclk] \
  [get_bd_pins zynq_ultra_ps_e_0/saxihp0_fpd_aclk] [get_bd_pins zynq_ultra_ps_e_0/saxihp1_fpd_aclk] \
  [get_bd_pins zynq_ultra_ps_e_0/saxihp2_fpd_aclk] [get_bd_pins zynq_ultra_ps_e_0/saxihp3_fpd_aclk]
connect_bd_net [get_bd_pins base_clocking/clk_out4] [get_bd_pins clk_out4]
connect_bd_net [get_bd_pins base_clocking/clk_out5] [get_bd_pins clk_out5]
connect_bd_net [get_bd_pins base_clocking/clk_out6] [get_bd_pins clk_out6]
connect_bd_net [get_bd_pins base_clocking/clk_out7] [get_bd_pins clk_out7]
connect_bd_net -net base_clocking_interconnect_aresetn [get_bd_pins base_clocking/psreset_ctrlclk_interconnect_aresetn] \
  [get_bd_pins axi_intc_0/s_axi_aresetn] [get_bd_pins axi_interconnect_0/ARESETN] \
  [get_bd_pins axi_interconnect_0/M00_ARESETN] [get_bd_pins axi_interconnect_0/M01_ARESETN] \
  [get_bd_pins axi_interconnect_0/S00_ARESETN] [get_bd_pins axi_interconnect_mgmt/ARESETN] \
  [get_bd_pins axi_interconnect_mgmt/M00_ARESETN] [get_bd_pins axi_interconnect_mgmt/S00_ARESETN] \
  [get_bd_pins axi_interconnect_user/ARESETN] [get_bd_pins axi_interconnect_user/M00_ARESETN] \
  [get_bd_pins axi_interconnect_user/M01_ARESETN] [get_bd_pins axi_interconnect_user/M02_ARESETN] \
  [get_bd_pins axi_interconnect_user/S00_ARESETN] [get_bd_pins debug_bridge_xvc/s_axi_aresetn] \
  [get_bd_pins pr_isolation_expanded/psreset_ctrlclk_interconnect_aresetn]
connect_bd_net -net base_clocking_locked [get_bd_pins base_clocking/clkwiz_kernel_locked] \
  [get_bd_pins clkwiz_kernel_locked] [get_bd_pins pr_isolation_expanded/clkwiz_kernel_locked]
connect_bd_net -net base_clocking_locked1 [get_bd_pins base_clocking/clkwiz_sysclks_locked] \
  [get_bd_pins clkwiz_sysclks_locked] [get_bd_pins pr_isolation_expanded/clkwiz_sysclks_locked]
connect_bd_net -net base_clocking_locked2 [get_bd_pins base_clocking/clkwiz_kernel2_locked] [get_bd_pins clkwiz_kernel2_locked]
connect_bd_net [get_bd_pins debug_bridge_xvc/m0_bscan_bscanid_en] [get_bd_pins m0_bscan_bscanid_en]
connect_bd_net [get_bd_pins debug_bridge_xvc/m0_bscan_capture] [get_bd_pins m0_bscan_capture]
connect_bd_net [get_bd_pins debug_bridge_xvc/m0_bscan_drck] [get_bd_pins m0_bscan_drck]
connect_bd_net [get_bd_pins debug_bridge_xvc/m0_bscan_reset] [get_bd_pins m0_bscan_reset]
connect_bd_net [get_bd_pins debug_bridge_xvc/m0_bscan_runtest] [get_bd_pins m0_bscan_runtest]
connect_bd_net [get_bd_pins debug_bridge_xvc/m0_bscan_sel] [get_bd_pins m0_bscan_sel]
connect_bd_net [get_bd_pins debug_bridge_xvc/m0_bscan_shift] [get_bd_pins m0_bscan_shift]
connect_bd_net [get_bd_pins debug_bridge_xvc/m0_bscan_tck] [get_bd_pins m0_bscan_tck]
connect_bd_net [get_bd_pins debug_bridge_xvc/m0_bscan_tdi] [get_bd_pins m0_bscan_tdi]
connect_bd_net [get_bd_pins debug_bridge_xvc/m0_bscan_tms] [get_bd_pins m0_bscan_tms]
connect_bd_net [get_bd_pins debug_bridge_xvc/m0_bscan_update] [get_bd_pins m0_bscan_update]
connect_bd_net [get_bd_pins irq_cu] [get_bd_pins axi_intc_0/intr]
connect_bd_net [get_bd_pins m0_bscan_tdo] [get_bd_pins debug_bridge_xvc/m0_bscan_tdo]
connect_bd_net -net pr_isolation_expanded_interconnect_aresetn1 [get_bd_pins pr_isolation_expanded/psreset_regslice_data_pr_interconnect_aresetn] \
  [get_bd_pins axi_vip_0/aresetn] [get_bd_pins axi_vip_1/aresetn] [get_bd_pins axi_vip_2/aresetn] \
  [get_bd_pins axi_vip_data_m00_axi_1/aresetn]
connect_bd_net [get_bd_pins pr_isolation_expanded/slice_reset_kernel_pr_Dout] [get_bd_pins slice_reset_kernel_pr_Dout]
connect_bd_net [get_bd_pins xlconcat_0/dout] [get_bd_pins zynq_ultra_ps_e_0/pl_ps_irq0]
connect_bd_net [get_bd_pins zynq_ultra_ps_e_0/pl_clk0] [get_bd_pins base_clocking/pl_clk]
connect_bd_net [get_bd_pins zynq_ultra_ps_e_0/pl_resetn0] [get_bd_pins base_clocking/pl_resetn]

current_bd_instance /static_region/base_clocking
connect_bd_net [get_bd_pins clkwiz_sysclks/clk_out1] [get_bd_pins clkwiz_kernel_clk_out1]
connect_bd_net [get_bd_pins clkwiz_sysclks/clk_out3] [get_bd_pins clkwiz_sysclks_clk_out2] [get_bd_pins psreset_ctrlclk/slowest_sync_clk]
connect_bd_net [get_bd_pins clkwiz_sysclks/clk_out2] [get_bd_pins clkwiz_kernel2_clk_out1]
connect_bd_net [get_bd_pins clkwiz_sysclks/clk_out4] [get_bd_pins clk_out4]
connect_bd_net [get_bd_pins clkwiz_sysclks/clk_out5] [get_bd_pins clk_out5]
connect_bd_net [get_bd_pins clkwiz_sysclks/clk_out6] [get_bd_pins clk_out6]
connect_bd_net [get_bd_pins clkwiz_sysclks/clk_out7] [get_bd_pins clk_out7]
connect_bd_net [get_bd_pins clkwiz_sysclks/locked] \
  [get_bd_pins clkwiz_kernel2_locked] [get_bd_pins clkwiz_kernel_locked] [get_bd_pins clkwiz_sysclks_locked] \
  [get_bd_pins psreset_ctrlclk/dcm_locked]
connect_bd_net -net dma_pcie_axi_aclk_1 [get_bd_pins pl_clk] [get_bd_pins clkwiz_sysclks/clk_in1]
connect_bd_net -net dma_pcie_axi_aresetn_1 [get_bd_pins pl_resetn] [get_bd_pins clkwiz_sysclks/resetn] [get_bd_pins psreset_ctrlclk/ext_reset_in]
connect_bd_net -net proc_sys_reset_0_interconnect_aresetn [get_bd_pins psreset_ctrlclk/interconnect_aresetn] \
  [get_bd_pins psreset_ctrlclk_interconnect_aresetn]

current_bd_instance /static_region/pr_isolation_expanded
connect_bd_intf_net [get_bd_intf_pins interconnect_axilite_static_secondary_b_M00_AXI] [get_bd_intf_pins gate_pr/S_AXI]
connect_bd_intf_net [get_bd_intf_pins M_AXI] [get_bd_intf_pins regslice_ddrmem_3/M_AXI]
connect_bd_intf_net [get_bd_intf_pins S_AXI1] [get_bd_intf_pins regslice_ddrmem_3/S_AXI]
connect_bd_intf_net [get_bd_intf_pins S_AXI3] [get_bd_intf_pins regslice_data_periph_1/S_AXI]
connect_bd_intf_net [get_bd_intf_pins M_AXI3] [get_bd_intf_pins axi_register_slice_1/M_AXI]
connect_bd_intf_net [get_bd_intf_pins S02_AXI] [get_bd_intf_pins regslice_control_userpf/S_AXI]
connect_bd_intf_net [get_bd_intf_pins S_AXI5] [get_bd_intf_pins axi_register_slice_1/S_AXI]
connect_bd_intf_net [get_bd_intf_pins regslice_control_userpf_M_AXI] [get_bd_intf_pins regslice_control_userpf/M_AXI]
connect_bd_intf_net [get_bd_intf_pins M_AXI2] [get_bd_intf_pins axi_register_slice_0/M_AXI]
connect_bd_intf_net [get_bd_intf_pins S_AXI4] [get_bd_intf_pins axi_register_slice_0/S_AXI]
connect_bd_intf_net [get_bd_intf_pins M_AXI1] [get_bd_intf_pins regslice_data_periph_1/M_AXI]
connect_bd_intf_net [get_bd_intf_pins S_AXI] [get_bd_intf_pins regslice_ddrmem_2/S_AXI]
connect_bd_intf_net [get_bd_intf_pins regslice_ddrmem_2] [get_bd_intf_pins regslice_ddrmem_2/M_AXI]
connect_bd_net -net M00_ACLK_1 [get_bd_pins clkwiz_sysclks_clk_out2] \
  [get_bd_pins gate_pr/s_axi_aclk] [get_bd_pins psreset_regslice_ctrl_pr/slowest_sync_clk] \
  [get_bd_pins regslice_control_userpf/aclk]
connect_bd_net -net M00_ARESETN_1 [get_bd_pins psreset_ctrlclk_interconnect_aresetn] \
  [get_bd_pins gate_pr/s_axi_aresetn] [get_bd_pins psreset_regslice_ctrl_pr/ext_reset_in] \
  [get_bd_pins psreset_regslice_data_pr/ext_reset_in]
connect_bd_net -net clkwiz_kernel2_clk_out1_1 [get_bd_pins clkwiz_kernel2_clk_out1] \
  [get_bd_pins axi_register_slice_0/aclk] [get_bd_pins axi_register_slice_1/aclk] \
  [get_bd_pins psreset_regslice_data_pr/slowest_sync_clk] [get_bd_pins regslice_data_periph_1/aclk] \
  [get_bd_pins regslice_ddrmem_2/aclk] [get_bd_pins regslice_ddrmem_3/aclk]
connect_bd_net [get_bd_pins clkwiz_kernel_locked] [get_bd_pins psreset_regslice_data_pr/dcm_locked]
connect_bd_net -net dcm_locked_2 [get_bd_pins clkwiz_sysclks_locked] [get_bd_pins psreset_regslice_ctrl_pr/dcm_locked]
connect_bd_net [get_bd_pins gate_pr/gpio_io_o] \
  [get_bd_pins gate_pr/gpio2_io_i] [get_bd_pins slice_reset_kernel_pr/Din] [get_bd_pins slice_reset_system_pr/Din]
connect_bd_net [get_bd_pins psreset_regslice_ctrl_pr/peripheral_aresetn] [get_bd_pins regslice_control_userpf/aresetn]
connect_bd_net -net psreset_regslice_pr_interconnect_aresetn [get_bd_pins psreset_regslice_data_pr/peripheral_aresetn] \
  [get_bd_pins psreset_regslice_data_pr_interconnect_aresetn] [get_bd_pins axi_register_slice_0/aresetn] \
  [get_bd_pins axi_register_slice_1/aresetn] [get_bd_pins regslice_data_periph_1/aresetn] \
  [get_bd_pins regslice_ddrmem_2/aresetn] [get_bd_pins regslice_ddrmem_3/aresetn]
connect_bd_net [get_bd_pins slice_reset_kernel_pr/Dout] [get_bd_pins slice_reset_kernel_pr_Dout]
connect_bd_net [get_bd_pins slice_reset_system_pr/Dout] \
  [get_bd_pins psreset_regslice_ctrl_pr/aux_reset_in] [get_bd_pins psreset_regslice_data_pr/aux_reset_in]

current_bd_instance /
connect_bd_intf_net [get_bd_intf_pins dynamic_region/interconnect_aximm_ddrmem4_M00_AXI] [get_bd_intf_pins static_region/S_AXI1]
connect_bd_intf_net [get_bd_intf_pins dynamic_region/regslice_control_userpf_M_AXI] [get_bd_intf_pins static_region/regslice_control_userpf_M_AXI]
connect_bd_intf_net [get_bd_intf_pins dynamic_region/interconnect_aximm_ddrmem2_M00_AXI] [get_bd_intf_pins static_region/S_AXI_0]
connect_bd_intf_net [get_bd_intf_pins dynamic_region/interconnect_aximm_ddrmem5_M00_AXI] [get_bd_intf_pins static_region/S_AXI2]
connect_bd_intf_net [get_bd_intf_pins dynamic_region/interconnect_aximm_ddrmem3_M00_AXI] [get_bd_intf_pins static_region/S_AXI]
connect_bd_intf_net [get_bd_intf_pins dynamic_region/regslice_data_hpm0fpd_M_AXI1] [get_bd_intf_pins static_region/M_AXI]
connect_bd_net [get_bd_pins dynamic_region/tdo] [get_bd_pins static_region/m0_bscan_tdo]
connect_bd_net [get_bd_pins dynamic_region/xlconcat_interrupt_dout] [get_bd_pins static_region/irq_cu]
connect_bd_net -net slowest_sync_clk_1 [get_bd_pins static_region/clkwiz_sysclks_clk_out2] [get_bd_pins dynamic_region/clkwiz_sysclks_clk_out2]
connect_bd_net -net static_region_clk_out1 [get_bd_pins static_region/clkwiz_kernel_clk_out1] [get_bd_pins dynamic_region/clkwiz_kernel_clk_out1]
connect_bd_net -net static_region_clk_out3 [get_bd_pins static_region/clkwiz_kernel2_clk_out1] [get_bd_pins dynamic_region/clkwiz_kernel2_clk_out1]
connect_bd_net [get_bd_pins static_region/clk_out4] [get_bd_pins dynamic_region/clkwiz_kernel3_clk_out]
connect_bd_net [get_bd_pins static_region/clk_out5] [get_bd_pins dynamic_region/clkwiz_kernel4_clk_out]
connect_bd_net [get_bd_pins static_region/clk_out6] [get_bd_pins dynamic_region/clkwiz_kernel5_clk_out]
connect_bd_net [get_bd_pins static_region/clk_out7] [get_bd_pins dynamic_region/clkwiz_kernel6_clk_out]
connect_bd_net -net static_region_locked [get_bd_pins static_region/clkwiz_kernel_locked] [get_bd_pins dynamic_region/clkwiz_kernel_locked]
connect_bd_net -net static_region_locked1 [get_bd_pins static_region/clkwiz_sysclks_locked] [get_bd_pins dynamic_region/clkwiz_sysclks_locked]
connect_bd_net -net static_region_locked2 [get_bd_pins static_region/clkwiz_kernel2_locked] [get_bd_pins dynamic_region/clkwiz_kernel2_locked]
connect_bd_net [get_bd_pins static_region/m0_bscan_bscanid_en] [get_bd_pins dynamic_region/bscanid_en]
connect_bd_net [get_bd_pins static_region/m0_bscan_capture] [get_bd_pins dynamic_region/capture]
connect_bd_net [get_bd_pins static_region/m0_bscan_drck] [get_bd_pins dynamic_region/drck]
connect_bd_net [get_bd_pins static_region/m0_bscan_reset] [get_bd_pins dynamic_region/reset]
connect_bd_net [get_bd_pins static_region/m0_bscan_runtest] [get_bd_pins dynamic_region/runtest]
connect_bd_net [get_bd_pins static_region/m0_bscan_sel] [get_bd_pins dynamic_region/sel]
connect_bd_net [get_bd_pins static_region/m0_bscan_shift] [get_bd_pins dynamic_region/shift]
connect_bd_net [get_bd_pins static_region/m0_bscan_tck] [get_bd_pins dynamic_region/tck]
connect_bd_net [get_bd_pins static_region/m0_bscan_tdi] [get_bd_pins dynamic_region/tdi]
connect_bd_net [get_bd_pins static_region/m0_bscan_tms] [get_bd_pins dynamic_region/tms]
connect_bd_net [get_bd_pins static_region/m0_bscan_update] [get_bd_pins dynamic_region/update]
connect_bd_net [get_bd_pins static_region/slice_reset_kernel_pr_Dout] [get_bd_pins dynamic_region/pr_reset_n]

# ---- address map ----
assign_bd_address -offset 0x00000000 -range 2G -target_address_space [get_bd_addr_spaces dynamic_region/interconnect_aximm_ddrmem2_M00_AXI] [get_bd_addr_segs static_region/zynq_ultra_ps_e_0/SAXIGP5/HP3_DDR_LOW]
assign_bd_address -offset 0x00000000 -range 2G -target_address_space [get_bd_addr_spaces dynamic_region/interconnect_aximm_ddrmem3_M00_AXI] [get_bd_addr_segs static_region/zynq_ultra_ps_e_0/SAXIGP2/HP0_DDR_LOW]
assign_bd_address -offset 0x00000000 -range 2G -target_address_space [get_bd_addr_spaces dynamic_region/interconnect_aximm_ddrmem4_M00_AXI] [get_bd_addr_segs static_region/zynq_ultra_ps_e_0/SAXIGP3/HP1_DDR_LOW]
assign_bd_address -offset 0x00000000 -range 2G -target_address_space [get_bd_addr_spaces dynamic_region/interconnect_aximm_ddrmem5_M00_AXI] [get_bd_addr_segs static_region/zynq_ultra_ps_e_0/SAXIGP4/HP2_DDR_LOW]
assign_bd_address -offset 0x0080020000 -range 64K -target_address_space [get_bd_addr_spaces static_region/zynq_ultra_ps_e_0/Data] [get_bd_addr_segs static_region/axi_intc_0/S_AXI/Reg]
assign_bd_address -offset 0x0080070000 -range 64K -target_address_space [get_bd_addr_spaces static_region/zynq_ultra_ps_e_0/Data] [get_bd_addr_segs static_region/pr_isolation_expanded/gate_pr/S_AXI/Reg]
assign_bd_address -offset 0x0080090000 -range 64K -target_address_space [get_bd_addr_spaces static_region/zynq_ultra_ps_e_0/Data] [get_bd_addr_segs static_region/debug_bridge_xvc/S_AXI/Reg0]
assign_bd_address -offset 0x0080800000 -range 8M -target_address_space [get_bd_addr_spaces static_region/zynq_ultra_ps_e_0/Data] [get_bd_addr_segs dynamic_region/regslice_control_userpf_M_AXI/Reg]
assign_bd_address -offset 0x00A0000000 -range 8M -target_address_space [get_bd_addr_spaces static_region/zynq_ultra_ps_e_0/Data] [get_bd_addr_segs dynamic_region/regslice_data_hpm0fpd_M_AXI1/Reg]

validate_bd_design
save_bd_design
